# Altium schematic sheet FPGA_GTP.SchDoc: TE0723 - FPGA RAM
size A4; PageSetup: Record=PageOptions|CenterHorizontal=True|CenterVertical=True|PrintScale=0.96|XCorrection=1.00|YCorrection=1.00|PrintKind=0|BorderSize=5000000|LeftOffset=0|BottomOffset=0|Orientation=2|PaperLength=1000|PaperWidth=1000|Scale=100|PaperSource=7|PrintQuality=-4|MediaType=1|DitherType=10|PaperKind=A4|PrintScaleMode=1; Organization: Trenz Electronic GmbH; DocumentNumber: TE0723; Revision: 01; SheetNumber: 6; SheetTotal: 12; Date: 08.07.2015; Author: Indrek Tubalkain; CompanyName: Trenz Electronic GmbH; DrawnBy: Indrek Tubalkain; Engineer: Indrek Tubalkain; ProjectName: TE0723 Arduino
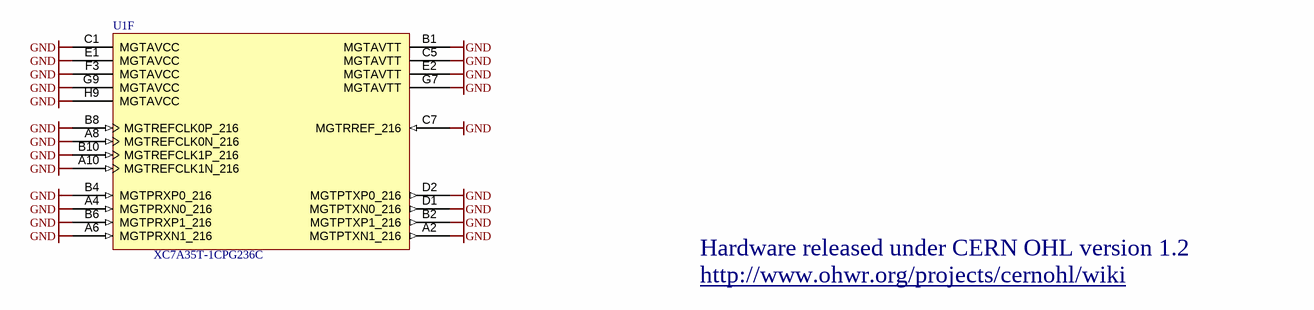
[diagram p0: FPGA_GTP.SchDoc]

## Parts
U1  XC7A35T-1CPG236C  [XC7AxxT-CPG236]  (part F of 8)

## Nets
GND: U1.A2(MGTPTXN1_216) U1.A4(MGTPRXN0_216) U1.A6(MGTPRXN1_216) U1.A8(MGTREFCLK0N_216) U1.A10(MGTREFCLK1N_216) U1.B1(MGTAVTT) U1.B2(MGTPTXP1_216) U1.B4(MGTPRXP0_216) U1.B6(MGTPRXP1_216) U1.B8(MGTREFCLK0P_216) U1.B10(MGTREFCLK1P_216) U1.C1(MGTAVCC) U1.C5(MGTAVTT) U1.C7(MGTRREF_216) U1.D1(MGTPTXN0_216) U1.D2(MGTPTXP0_216) U1.E1(MGTAVCC) U1.E2(MGTAVTT) U1.F3(MGTAVCC) U1.G7(MGTAVTT) U1.G9(MGTAVCC) U1.H9(MGTAVCC)

## Notes on the sheet
- Hardware released under CERN OHL version 1.2
- http://www.ohwr.org/projects/cernohl/wiki
- Title:
- Number:
- Rev.
- Date:
- A4
- Copyright:
- Page
- of
- Filename:

## Library data of the parts
U1 = 26752: AN: 26752; Mixed: SMT; Trenz-Stock: Yes; Case: CPG236; HelpURL: B:\ad\adlib\datasheet\XC7